# EAGLE design EGB240_n11291419 (EAGLE 9.6.2)
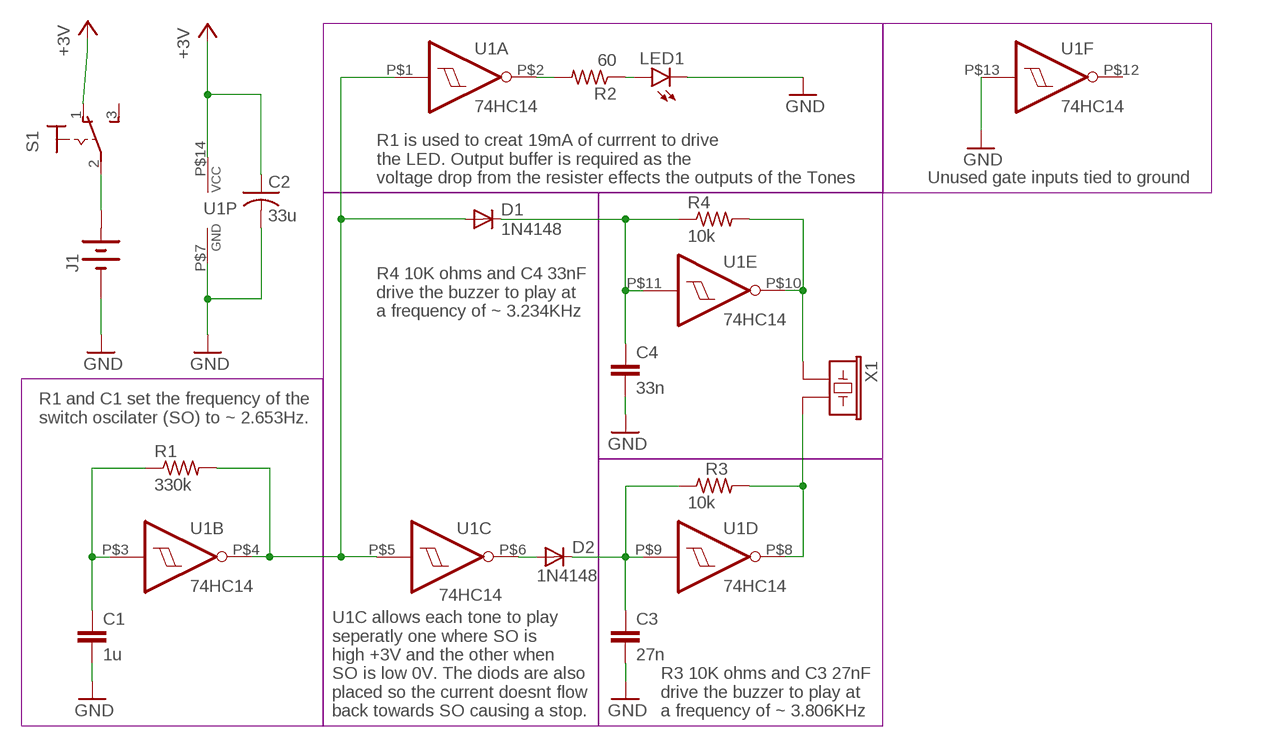
[diagram p0: schematic, sheet 1]

## Parts
C1  1u  CAPCERAMIC-DISC  [CAP-DISC-P5.08]
C2  33u  CAP-POLRB-D5.0XP2.0  [CAP-RB-P2.0-D5.0]
C3  27n  CAPMKT-7.5X3.2  [CAP-MKT-7.5X3.2-P5.08]
C4  33n  CAPMKT-7.5X3.2  [CAP-MKT-7.5X3.2-P5.08]
D1  1N4148  DIODE-DO35DO35-P7.62  [DO35-P7.62]
D2  1N4148  DIODE-DO35DO35-P7.62  [DO35-P7.62]
J1  BATTERY-3VBATT  [BATT-3V]
LED1  LED5MM  [LED5MM]
R1  330k  RESISTOR-AXIALVERTICAL  [AXIAL-P2.54]
R2  60  RESISTOR-AXIALVERTICAL  [AXIAL-P2.54]
R3  10k  RESISTOR-AXIALVERTICAL  [AXIAL-P2.54]
R4  10k  RESISTOR-AXIALVERTICAL  [AXIAL-P2.54]
S1  SWITCH-SPDT  [SS-12]
U1  74HC14  [DIP-14]
X1  BUZZER-PIEZOPS1720P02  [PS1720P02]

## Nets
+3V: C2.P$1 S1.1(O) U1.P$14(P:VCC)
GND: C1.P$2 C2.P$2 C3.P$2 C4.P$2 J1.P$2(-) LED1.K(C) U1.P$7(P:GND) U1.P$13(F:I)
N$1: J1.P$1(+) S1.2(P)
N$2: C1.P$1 R1.P$1 U1.P$3(B:I)
N$3: D1.A R1.P$2 U1.P$1(A:I) U1.P$4(B:O) U1.P$5(C:I)
N$4: R4.P$2 U1.P$10(E:O) X1.P$1
N$5: R3.P$2 U1.P$8(D:O) X1.P$2
N$6: C4.P$1 D1.K R4.P$1 U1.P$11(E:I)
N$7: C3.P$1 D2.K R3.P$1 U1.P$9(D:I)
N$8: LED1.A R2.P$1
N$10: R2.P$2 U1.P$2(A:O)
N$11: D2.A U1.P$6(C:O)
Unconnected: S1.3(S) U1.P$12(F:O)

## Notes on the sheet
- R1 is used to creat 19mA of currrent to drive 
  the LED. Output buffer is required as the 
  voltage drop from the resister effects the outputs of the Tones
- Unused gate inputs tied to ground
- R4 10K ohms and C4 33nF 
  drive the buzzer to play at 
  a frequency of ~ 3.234KHz
- R1 and C1 set the frequency of the
  switch oscilater (SO) to ~ 2.653Hz.
- U1C allows each tone to play 
  seperatly one where SO is 
  high +3V and the other when 
  SO is low 0V. The diods are also
  placed so the current doesnt flow
  back towards SO causing a stop.
- R3 10K ohms and C3 27nF 
  drive the buzzer to play at 
  a frequency of ~ 3.806KHz

## Library data of the parts
C1 C3 C4 = EGB240:CAP: Capacitor, Radial, Non-polarised
C2 = EGB240:CAP-POL: Capacitor, Radial, Polarised
D1 = EGB240:DIODE-DO35: Diode, Axial, DO-35
D2 = EGB240:DIODE-DO35: Diode, Axial, DO-35; SPICEPREFIX: D
J1 = EGB240:BATTERY-3V: Battery holder, 3V, 2xAA, flying leads
LED1 = led:LED: LED OSRAM: - CHIPLED LG R971, LG N971, LY N971, LG Q971, LY Q971, LO R971, LY R971 LH N974, LH R974 LS Q976, LO Q976, LY Q976 LO Q996 - Hyper CHIPLED LW Q18S LB Q993, LB Q99A, LB R99A - SideLED LS A670, LO A670, LY A670, LG A670, LP A670 LB A673, LV A673, LT A673, LW A673 LH A674 LY A675 LS A676, LA A676, LO A676, LY A676, LW A676 LS A679, LY A679, LG A679 - Hyper Micro SIDELED® LS Y876, LA Y876, LO Y876, LY Y876 LT Y87S - SmartLED LW L88C, LW L88S LB L89C, LB L89S, LG L890 LS L89K, LO L89K, LY L89K LS L896, LA L896, LO L896, LY L896 - TOPLED LS T670, LO T670, LY T670, LG T670, LP T670 LSG T670, LSP T670, LSY T670, LOP T670, LYG T670 LG T671, LOG T671, LSG T671 LB T673, LV T673, LT T673, LW T673 LH T674 LS T676, LA T676, LO T676, LY T676, LB T676, LH T676, LSB T676, LW T676 LB T67C, LV T67C, LT T67C, LS T67K, LO T67K, LY T67K, LW E67C LS E67B, LA E67B, LO E67B, LY E67B, LB E67C, LV E67C, LT E67C LW T67C LS T679, LY T679, LG T679 LS T770, LO T770, LY T770, LG T770, LP T770 LB T773, LV T773, LT T773, LW T773 LH T774 LS E675, LA E675, LY E675, LS T675 LS T776, LA T776, LO T776, LY T776, LB T776 LHGB T686 LT T68C, LB T68C - Hyper Mini TOPLED® LB M676 - Mini TOPLED Santana® LG M470 LS M47K, LO M47K, LY M47K Source: http://www.osram.convergy.de LUXEON: - LUMILED® LXK2-PW12-R00, LXK2-PW12-S00, LXK2-PW14-U00, LXK2-PW14-V00 LXK2-PM12-R00, LXK2-PM12-S00, LXK2-PM14-U00 LXK2-PE12-Q00, LXK2-PE12-R00, LXK2-PE12-S00, LXK2-PE14-T00, LXK2-PE14-U00 LXK2-PB12-K00, LXK2-PB12-L00, LXK2-PB12-M00, LXK2-PB14-N00, LXK2-PB14-P00, LXK2-PB14-Q00 LXK2-PR12-L00, LXK2-PR12-M00, LXK2-PR14-Q00, LXK2-PR14-R00 LXK2-PD12-Q00, LXK2-PD12-R00, LXK2-PD12-S00 LXK2-PH12-R00, LXK2-PH12-S00 LXK2-PL12-P00, LXK2-PL12-Q00, LXK2-PL12-R00 Source: www.luxeon.com KINGBRIGHT: KA-3528ASYC Source: www.kingbright.com
R1-R4 = EGB240:RESISTOR-AXIAL: Resistor, Axial, 0.25W
S1 = EGB240:SWITCH-SPDT: Switch, SPDT, Slide, On-On
U1 = EGB240:74HC14: Hex schmitt trigger INVERTER
X1 = EGB240:BUZZER-PIEZO

## Module 5V
Ports: 

### Library data of the parts

## Board
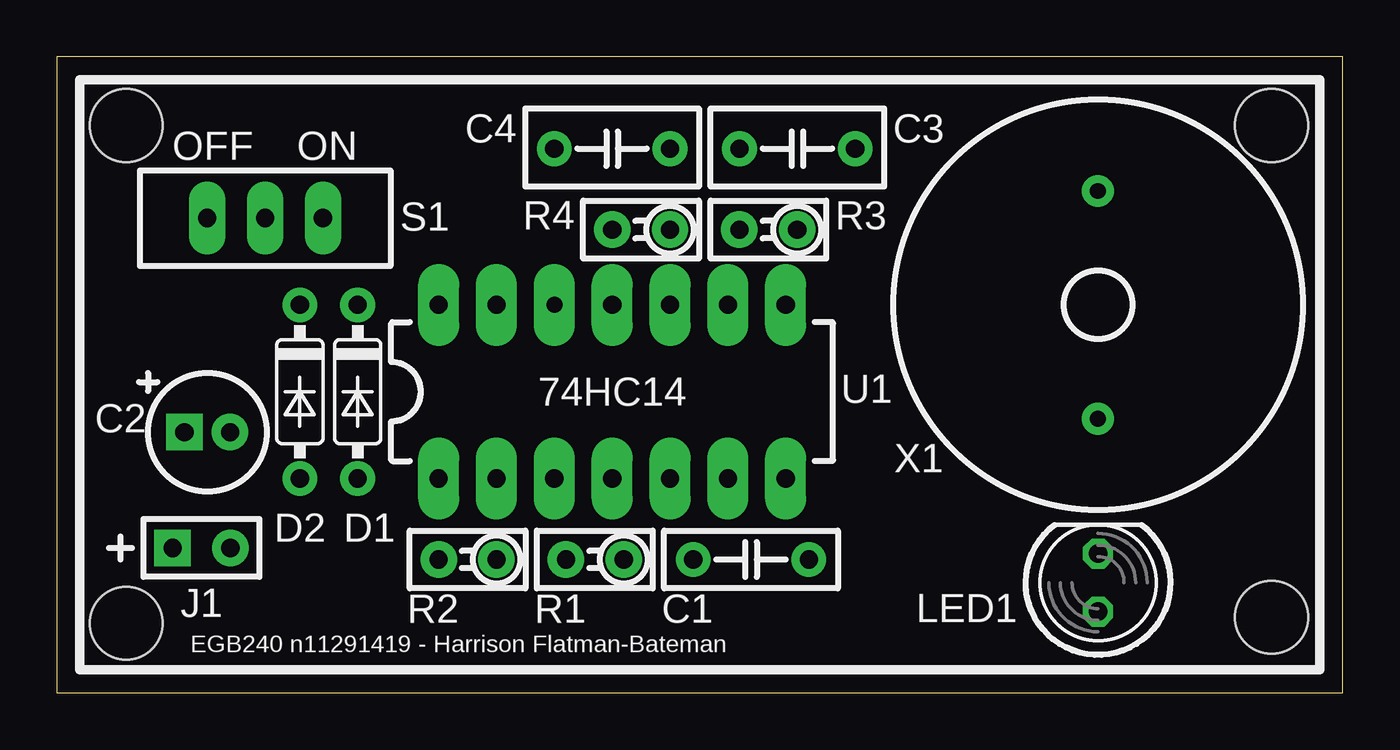
[diagram p1: board, top side]
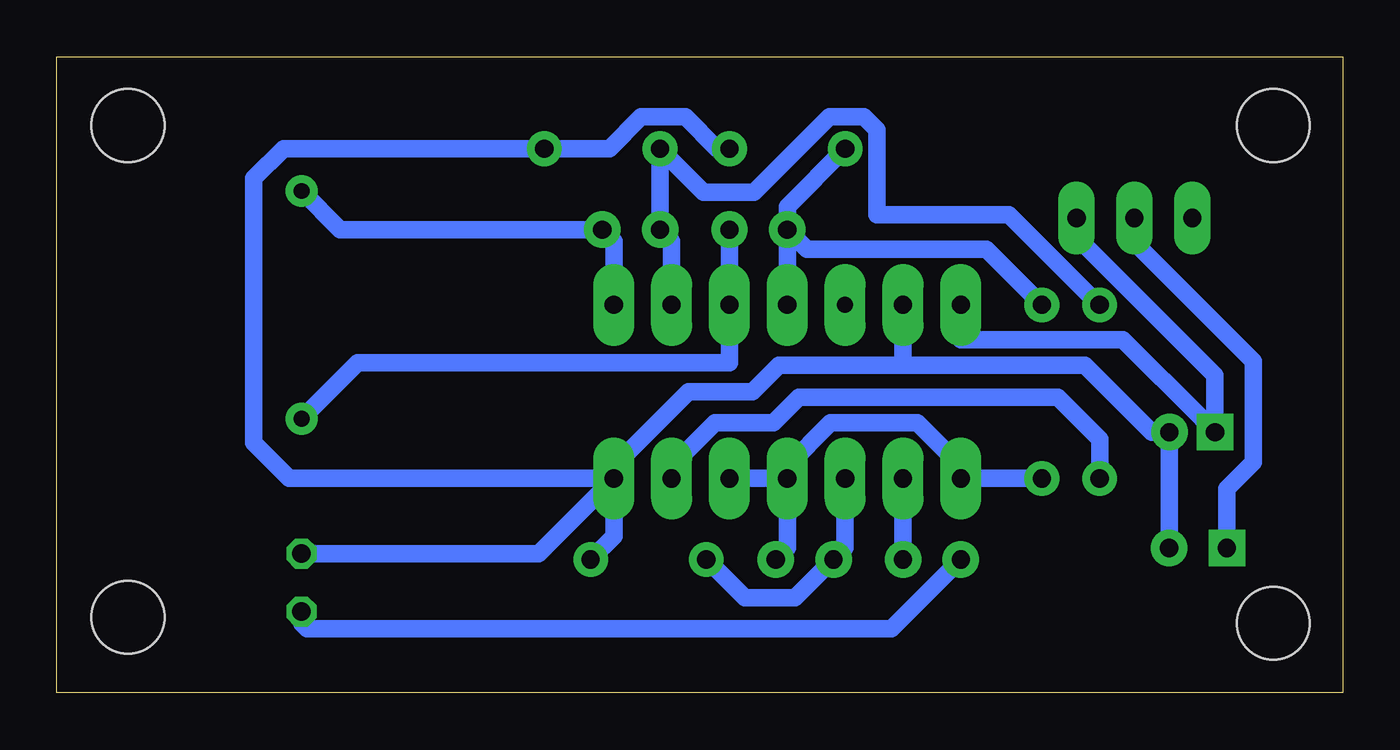
[diagram p2: board, bottom side, seen from below]

Size 56.46 x 27.9 mm. Coordinates in mm from the lower left corner, seen from the top.
Outline: 0,0 56.46,0 56.46,27.9 0,27.9 0,0
Copper layers (1*16): Top 0.035mm / dielectric 1.5mm / Bottom 0.035mm
Design rules "default *": minimum track width 10mil, minimum drill 20mil, track to track 10mil, track to pad 10mil, pad to pad 10mil, via to via 10mil, smd to smd 8mil, copper to edge 1mm, drill to drill 20mil, minimum pad ring 10mil, minimum via ring 8mil, stop-mask expansion 4mil, vias tented up to drill 0mil, thermal gap 10mil
Holes 3.2 mm at 3.05,3.05 3.05,24.89 53.34,3.3 53.34,24.89
bKeepout: 4 lines

### Footprints (pad centres in the part's own frame; a part is rotated, then mirrored left to right if it is on the bottom)
CAP-DISC-P5.08 = drill 0.8 pad 1.524: P$1 -2.54,0; P$2 2.54,0
CAP-RB-P2.0-D5.0 = drill 0.8 pad 1.6 square: P$1 -1,0 | drill 0.8 pad 1.6: P$2 1,0
CAP-MKT-7.5X3.2-P5.08 = drill 0.8 pad 1.524: P$1 -2.54,0; P$2 2.54,0
DO35-P7.62 = drill 0.8 pad 1.524: A 3.81,0; K -3.81,0
BATT-3V = drill 0.8 pad 1.6 square: P$1 -1.27,0 | drill 0.8 pad 1.6: P$2 1.27,0
LED5MM = drill 0.813 octagon: A -1.27,0; K 1.27,0
AXIAL-P2.54 = drill 0.8 pad 1.6: P$1 -1.27,0; P$2 1.27,0
SS-12 = drill 0.8 pad 1.6 long: 1 0,2.54; 2 0,0; 3 0,-2.54
DIP-14 = drill 0.8 pad 1.8 long: P$1 -3.81,7.62; P$2 -3.81,5.08; P$3 -3.81,2.54; P$4 -3.81,0; P$5 -3.81,-2.54; P$6 -3.81,-5.08; P$7 -3.81,-7.62; P$8 3.81,-7.62; P$9 3.81,-5.08; P$10 3.81,-2.54; P$11 3.81,0; P$13 3.81,5.08; P$14 3.81,7.62 | drill 0.7 pad 1.8 long: P$12 3.81,2.54
PS1720P02 = drill 0.7 pad 1.4: P$1 -5,0; P$2 5,0

### Placement (x,y rotation side)
C1  30.48,5.84 0 top
C2  6.6,11.43 0 top
C3  32.51,23.88 0 top
C4  24.38,23.88 0 top
D1  13.21,13.21 270 top
D2  10.67,13.21 270 top
J1  6.35,6.35 0 top
LED1  45.72,4.83 90 top
R1  23.62,5.84 0 top
R2  18.03,5.84 0 top
R3  31.24,20.32 0 top
R4  25.65,20.32 0 top
S1  9.14,20.83 270 top
U1  24.38,13.21 90 top
X1  45.72,17.02 90 top

### Tracks (layer width: path | path; a pad name or v marks a point on that pad's centre or on a via)
+3V
  Bottom 0.762: U1.P$14 16.76,15.49 9.64,15.49 6.17,12.02 6.17,11.99 C2.P$1 5.6,13.93 11.68,20.01 S1.1
GND
  Bottom 0.762: 19.3,14.37 11.31,14.37 8.37,11.43 C2.P$2 7.6,6.37 J1.P$2 | U1.P$7 32,6.86 C1.P$2 | C4.P$2 27.46,23.88 28.86,25.27 30.8,25.27 32.2,23.88 C3.P$2 46.51,23.88 47.82,22.57 47.82,10.96 46.26,9.4 U1.P$7 | U1.P$13 19.3,14.37 | LED1.K 35.31,6.1 U1.P$7 | 19.3,14.37 24.74,14.37 25.91,13.21 28.73,13.21 32,9.93 U1.P$7
N$1
  Bottom 0.762: J1.P$1 5.08,8.95 3.92,10.11 3.92,14.55 9.14,19.78 S1.2
N$2
  Bottom 0.762: U1.P$3 21.84,6.35 R1.P$1 24.04,4.15 26.25,4.15 C1.P$1
N$3
  Bottom 0.762: D1.A U1.P$1 16.76,9.93 18.67,11.83 22.48,11.83 24.38,9.93 U1.P$4 | R1.P$2 24.38,6.35 U1.P$4 | U1.P$4 U1.P$5
N$4
  Bottom 0.762: X1.P$1 43.26,14.48 26.92,14.48 U1.P$10 R4.P$2
N$5
  Bottom 0.762: U1.P$8 32,19.81 R3.P$2 44.02,20.32 X1.P$2
N$6
  Bottom 0.762: D1.K 15.64,19.45 23.52,19.45 R4.P$1 | R4.P$1 U1.P$11 | C4.P$1 24.38,21.34 R4.P$1
N$7
  Bottom 0.762: D2.K 10.7,17.02 14.66,20.98 20.45,20.98 20.45,24.71 21.01,25.27 22.54,25.27 25.84,21.97 28.07,21.97 C3.P$1 R3.P$1 29.46,19.81 U1.P$9
N$8
  Bottom 0.762: LED1.A 45.72,3.05 45.47,2.79 19.81,2.79 R2.P$1
N$10
  Bottom 0.762: U1.P$2 R2.P$2
N$11
  Bottom 0.762: D2.A 10.67,11.12 12.5,12.95 23.88,12.95 25,11.83 27.56,11.83 29.46,9.93 U1.P$6

### Text on the board
tPlace: OFF | ON | EGB240 n11291419 - Harrison Flatman-Bateman